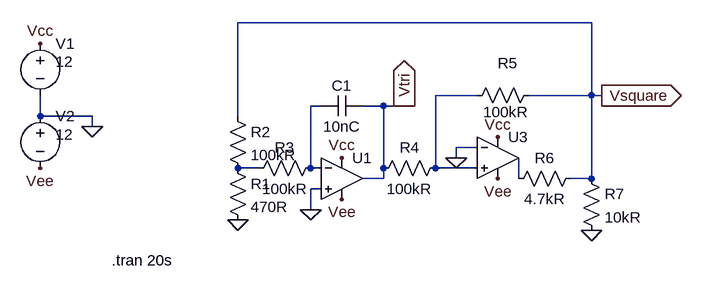
[diagram p0: schematic simpleLFO.asc]
simpleLFO.asc, the LTspice schematic file:
Version 4
SHEET 1 932 680
WIRE 496 -80 -48 -80
WIRE 320 32 256 32
WIRE 496 32 496 -80
WIRE 496 32 400 32
WIRE 512 32 496 32
WIRE 80 48 64 48
WIRE 176 48 144 48
WIRE 208 48 176 48
WIRE 224 48 208 48
WIRE -352 64 -352 32
WIRE -272 64 -352 64
WIRE -48 64 -48 -80
WIRE -272 80 -272 64
WIRE 320 112 288 112
WIRE 288 128 288 112
WIRE -16 144 -48 144
WIRE 64 144 64 48
WIRE 80 144 64 144
WIRE 176 144 176 48
WIRE 256 144 256 32
WIRE 320 144 256 144
WIRE 176 160 176 144
WIRE 176 160 144 160
WIRE 384 160 384 128
WIRE 496 160 496 32
WIRE 496 160 464 160
WIRE 80 176 64 176
WIRE 64 208 64 176
FLAG 64 208 0
FLAG -48 224 0
FLAG -272 80 0
FLAG -352 -48 Vcc
FLAG 112 128 Vcc
FLAG 352 96 Vcc
FLAG -352 144 Vee
FLAG 112 192 Vee
FLAG 352 160 Vee
FLAG 496 240 0
FLAG 208 48 Vtri
IOPIN 208 48 Out
FLAG 512 32 Vsquare
IOPIN 512 32 Out
FLAG 288 128 0
SYMBOL Opamps\\UniversalOpamp2 112 160 R0
SYMATTR InstName U1
SYMATTR SpiceLine ilimit=25m rail=0 Vos=0.1µ phimargin=45
SYMBOL res -64 128 R0
SYMATTR InstName R1
SYMATTR Value 470R
SYMBOL res -64 48 R0
SYMATTR InstName R2
SYMATTR Value 100kR
SYMBOL cap 144 32 R90
WINDOW 0 0 32 VBottom 2
WINDOW 3 32 32 VTop 2
SYMATTR InstName C1
SYMATTR Value 10nC
SYMBOL res 80 128 R90
WINDOW 0 0 56 VBottom 2
WINDOW 3 32 56 VTop 2
SYMATTR InstName R3
SYMATTR Value 100kR
SYMBOL Opamps\\UniversalOpamp2 352 128 R0
SYMATTR InstName U3
SYMATTR SpiceLine ilimit=25m rail=0 Vos=0.1µ phimargin=45
SYMBOL res 272 128 R90
WINDOW 0 0 56 VBottom 2
WINDOW 3 32 56 VTop 2
SYMATTR InstName R4
SYMATTR Value 100kR
SYMBOL res 416 16 R90
WINDOW 0 -18 49 VBottom 2
WINDOW 3 26 52 VTop 2
SYMATTR InstName R5
SYMATTR Value 100kR
SYMBOL res 368 176 R270
WINDOW 0 32 56 VTop 2
WINDOW 3 0 56 VBottom 2
SYMATTR InstName R6
SYMATTR Value 4.7kR
SYMBOL voltage -352 -64 R0
WINDOW 3 24 44 Left 2
WINDOW 123 0 0 Left 0
WINDOW 39 0 0 Left 0
SYMATTR InstName V1
SYMATTR Value 12
SYMBOL res 480 144 R0
SYMATTR InstName R7
SYMATTR Value 10kR
SYMBOL voltage -352 48 R0
WINDOW 3 24 44 Left 2
WINDOW 123 0 0 Left 0
WINDOW 39 0 0 Left 0
SYMATTR InstName V2
SYMATTR Value 12
TEXT -242 286 Left 2 !.tran 20s

The netlist it stands for:
* simpleLFO.asc
XU1 0 N002 Vcc Vee Vtri level.2 Avol=1Meg GBW=10Meg Slew=10Meg ilimit=25m rail=0 Vos=0.1µ phimargin=45 en=0 enk=0 in=0 ink=0 Rin=500Meg  ; pins IN+ IN- V+ V- OUT
R1 N003 0 470R
R2 Vsquare N003 100kR
C1 Vtri N002 10nC
R3 N002 N003 100kR
XU3 N001 0 Vcc Vee N004 level.2 Avol=1Meg GBW=10Meg Slew=10Meg ilimit=25m rail=0 Vos=0.1µ phimargin=45 en=0 enk=0 in=0 ink=0 Rin=500Meg  ; pins IN+ IN- V+ V- OUT
R4 N001 Vtri 100kR
R5 Vsquare N001 100kR
R6 N004 Vsquare 4.7kR
V1 Vcc 0 12
R7 Vsquare 0 10kR
V2 0 Vee 12
.tran 20s
.lib UniversalOpamps2.sub
.backanno
.end